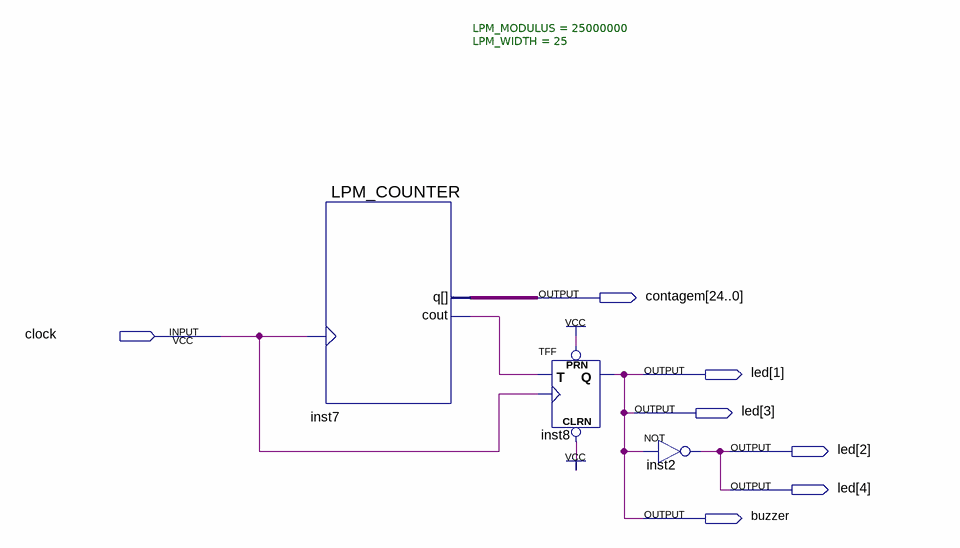
[diagram p0: schematic sheet]
// Quartus schematic exemplo1.bdf as structural Verilog: 3 symbols, 7 pins
module exemplo1 (
  input  clock,
  output [24:0] contagem,
  output [4:1] led,
  output buzzer
);

  wire inst7_cout;

  LPM_COUNTER #(.LPM_MODULUS(25000000), .LPM_WIDTH(25)) inst7 (.clock(clock), .cout(inst7_cout), .q(contagem));
  TFF inst8 (.PRN(1'b1), .CLRN(1'b1), .T(inst7_cout), .CLK(clock), .Q(buzzer));
  not inst2 (led[4], buzzer);

  assign led[3:1] = {buzzer, led[4], buzzer};
endmodule
